# Altium schematic sheet LCCAtmegaXXM1.2.SchDoc
size A0
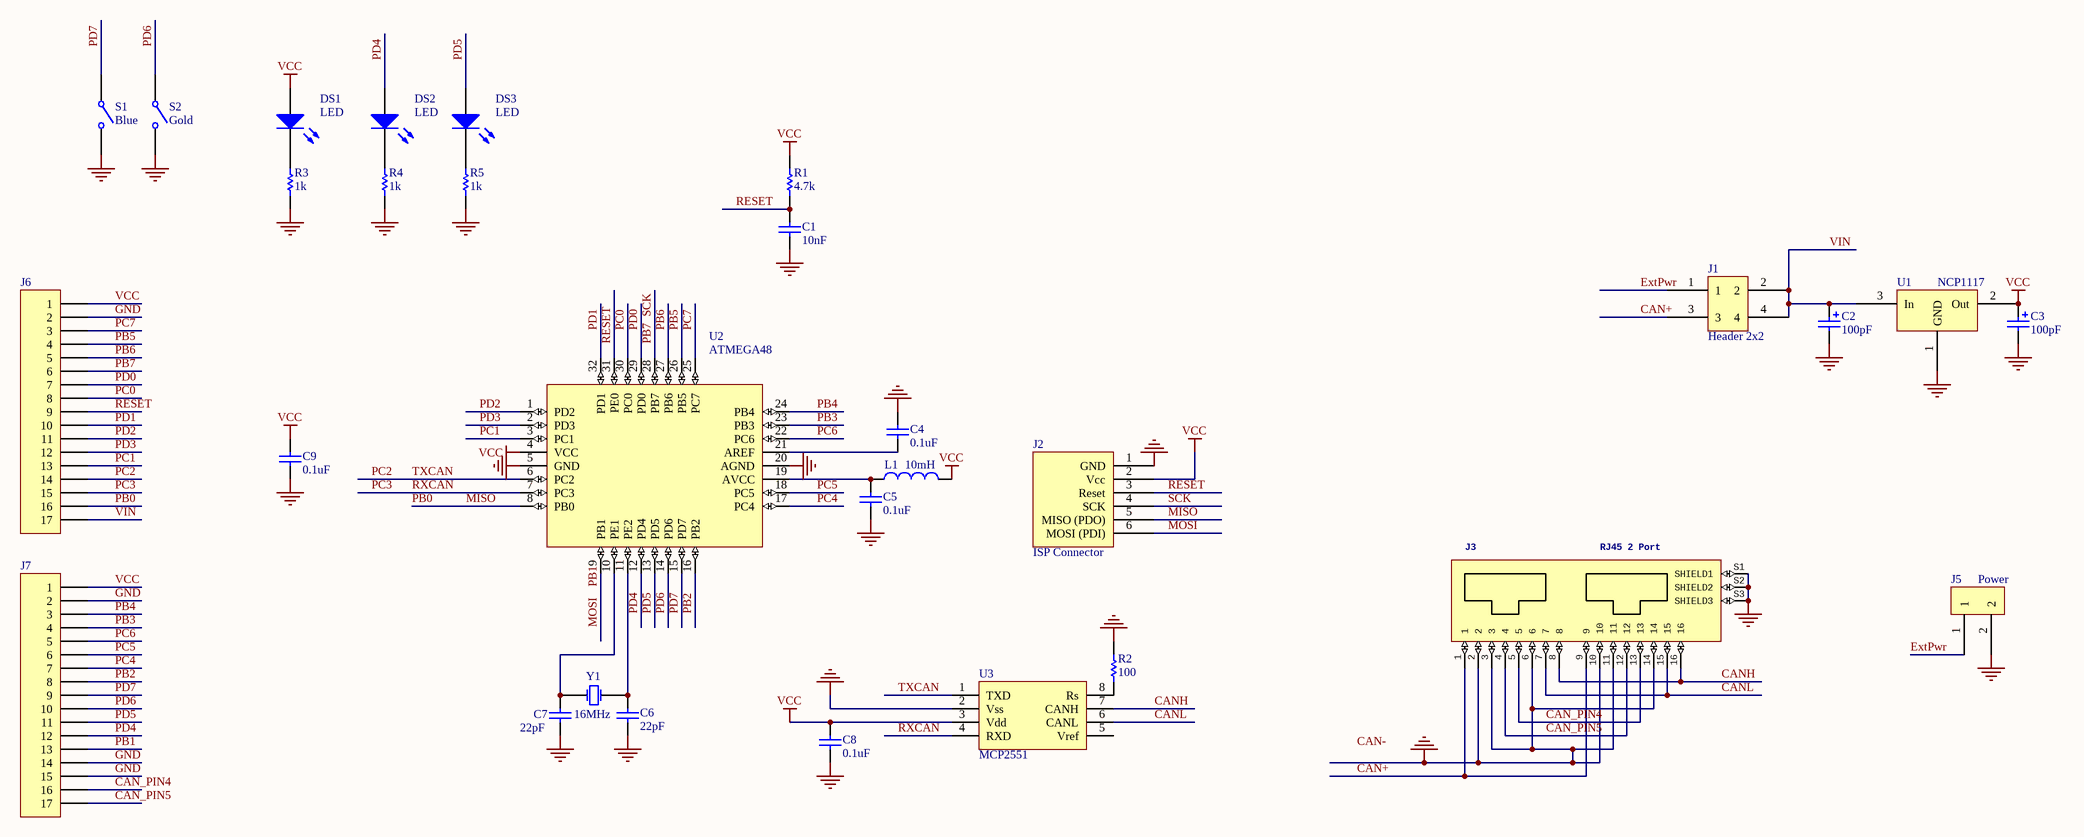
[diagram p0: LCCAtmegaXXM1.2.SchDoc]

## Parts
C1  value 10nF  [Cap SMD 0805A]  (hidden comment: Cap)
C2  value 100pF  [Cap SMD Elect 5x5.3]  (hidden comment: Cap Pol)
C3  value 100pF  [Cap SMD Elect 5x5.3]  (hidden comment: Cap Pol)
C4  value 0.1uF  [Cap SMD 0805A]  (hidden comment: Cap)
C5  value 0.1uF  [Cap SMD 0805A]  (hidden comment: Cap)
C6  value 22pF  [Cap SMD 0805A]  (hidden comment: Cap)
C7  value 22pF  [Cap SMD 0805A]  (hidden comment: Cap)
C8  value 0.1uF  [Cap SMD 0805A]  (hidden comment: Cap)
C9  value 0.1uF  [Cap SMD 0805A]  (hidden comment: Cap)
DS1  LED  [LED SMD 0805]
DS2  LED  [LED SMD 0805]
DS3  LED  [LED SMD 0805]
J1  Header 2x2  [HDR2x2]
J2  ISP Connector  [HDR2x3]
J3  RJ45 2 Port  [432238128]
J5  Power  [DC 2.5mm PCB Jack]
J6  Header 17  [HDR1X17]  (value not drawn)
J7  Header 17  [HDR1X17]  (value not drawn)
L1  value 10mH  [Cap SMD 0805A]  (hidden comment: Inductor)
R1  value 4.7k  [Res SMD 0805A]  (hidden comment: Res1)
R2  value 100  [Res SMD 0805A]  (hidden comment: Res1)
R3  value 1k  [Res SMD 0805A]  (hidden comment: Res1)
R4  value 1k  [Res SMD 0805A]  (hidden comment: Res1)
R5  value 1k  [Res SMD 0805A]  (hidden comment: Res1)
S1  Blue  [SPST Tactile 6x3.5]
S2  Gold  [SPST Tactile 6x3.5]
U1  NCP1117  [SOT-223]
U2  ATMEGA48  [TQFP32]
U3  MCP2551  [SOIC8]
Y1  16MHz  [Crystal TXC SMD]

## Nets
GND: C1.2 C2.2 C3.2 C4.2 C5.2 C6.1 C7.1 C8.2 C9.2 J2.1(GND) J3.2 J3.3 J3.6 J3.10 J3.11 J3.14 J3.S1(SHIELD1) J3.S2(SHIELD2) J3.S3(SHIELD3) J5.2 J6.2 J7.2 J7.14 J7.15 R2.1 R3.1 R4.1 R5.1 S1.2 S2.2 U1.1(GND) U2.5(GND) U2.20(AGND) U3.2(Vss)
VCC: C3.1 C8.1 C9.1 DS1.A J2.2(Vcc) J6.1 J7.1 L1.2 R1.2 U1.2(Out) U2.4(VCC) U3.3(Vdd)
CAN+: J1.3 J3.1 J3.9
CAN_PIN4: J3.5 J3.13 J7.16
CAN_PIN5: J3.4 J3.12 J7.17
CANH: J3.8 J3.16 U3.7(CANH)
CANL: J3.7 J3.15 U3.6(CANL)
ExtPwr: J1.1 J5.1
MISO: J2.5(MISO_(PDO)) J6.16 U2.8(PB0)  [also labelled PB0]
MOSI: J2.6(MOSI_(PDI)) J7.13 U2.9(PB1)  [also labelled PB1]
PB2: J7.8 U2.16(PB2)
PB3: J7.4 U2.23(PB3)
PB4: J7.3 U2.24(PB4)
PB5: J6.4 U2.26(PB5)
PB6: J6.5 U2.27(PB6)
PB7: J2.4(SCK) J6.6 U2.28(PB7)  [also labelled SCK]
PC0: J6.8 U2.30(PC0)
PC1: J6.13 U2.3(PC1)
PC2: J6.14 U2.6(PC2) U3.1(TXD)  [also labelled TXCAN]
PC3: J6.15 U2.7(PC3) U3.4(RXD)  [also labelled RXCAN]
PC4: J7.7 U2.17(PC4)
PC5: J7.6 U2.18(PC5)
PC6: J7.5 U2.22(PC6)
PC7: J6.3 U2.25(PC7)
PD0: J6.7 U2.29(PD0)
PD1: J6.10 U2.32(PD1)
PD2: J6.11 U2.1(PD2)
PD3: J6.12 U2.2(PD3)
PD4: DS2.A J7.12 U2.12(PD4)
PD5: DS3.A J7.11 U2.13(PD5)
PD6: J7.10 S2.1 U2.14(PD6)
PD7: J7.9 S1.1 U2.15(PD7)
RESET: C1.1 J2.3(Reset) J6.9 R1.1 U2.31(PE0)
VIN: C2.1 J1.2 J1.4 J6.17 U1.3(In)
NetC4_1: C4.1 U2.21(AREF)
NetC5_1: C5.1 L1.1 U2.19(AVCC)
NetC6_2: C6.2 U2.11(PE2) Y1.2(OSC2)
NetC7_2: C7.2 U2.10(PE1) Y1.1(OSC1)
NetDS1_K: DS1.K R3.2
NetDS2_K: DS2.K R4.2
NetDS3_K: DS3.K R5.2
NetR2_2: R2.2 U3.8(Rs)

Not connected (* = marked no-connect by the designer): U3 5(Vref)

## Notes on the sheet
- Labels drawn without touching a wire or pin: CAN-

## Library data of the parts
C1 C4-C9 = Cap: Capacitor; Published: 8-Jun-2000; LatestRevisionDate: 17-Jul-2002; LatestRevisionNote: Re-released for DXP Platform.; PackageReference: RAD-0.3; Publisher: Altium Limited; PackageDescription: Radial Cap, Thru-Hole; 2 Leads; 0.3 in Pin Spacing
C2 C3 = Cap Pol: Polarized Capacitor (Radial); Published: 8-Jun-2000; LatestRevisionDate: 17-Jul-2002; LatestRevisionNote: Re-released for DXP Platform.; PackageReference: RB7.6-15; Publisher: Altium Limited; PackageDescription: Polarized Capacitor (Radial); 2 Leads
DS1-DS3 = LED: RGB LED Common Anode; Published: 8-Jun-2000; Revision: July-2002: Re-released for DXP Platform.; Publisher: Altium Limited
J1 = HDR2x2
J2 = ISP Connector: pin to pad: 1>6 3>5 4>3 5>1 6>4
J3 = 43223-8128_1: Manufacturer_Name: Molex; GateName_1: G$1; SymbolName_1: 43223-8128; LibraryName: 43223-8128; DeviceSetName: 43223-8128; Mouser_Part_Number: 538-43223-8128; Mouser_Price-Stock: https://www.mouser.com/Search/Refine.aspx?Keyword=538-43223-8128; Manufacturer_Part_Number: 43223-8128; Height: 13.69mm
J5 = SIP2 CONNECTOR
J6 J7 = Header 17: Header, 17-Pin; LatestRevisionDate: 17-Jul-2002; LatestRevisionNote: Re-released for DXP Platform.; Publisher: Altium Limited
L1 = Inductor: Code_IEC: 1005; Published: 8-Jun-2000; LatestRevisionDate: 29-May-2009; LatestRevisionNote: IPC-7351 Footprint Added.; PackageReference: 0402-A; Publisher: Altium Limited; PackageDescription: Chip Inductor; Code_JEITA: 0402
R1-R5 = Resistor
S1 S2 = SW-PB-SPST: Push Button, Single-Pole, Single-Throw; Published: 24-Mar-1999; Revision: July-2002: Re-released for DXP Platform.; Publisher: Altium Limited
U1 = NCP1117: LDO Regulator
U2 = ATMEGA64M1: 8-Bit AVR Microcontroller; Package Information: Latest Revision: revB, Oct-2001; Code - JEDEC: MS-026-ABA; Published: 17-Sep-2003; Datasheet: Latest Revision: 1042G-AVR-09/02; Package Reference: 32A; Publisher: Altium Limited
U3 = MCP2551: MCP2551 High Speed CAN Transceiver
Y1 = XTAL: Crystal Oscillator; Published: 8-Jun-2000; LatestRevisionDate: 17-Jul-2002; LatestRevisionNote: Re-released for DXP Platform.; PackageReference: R38; Publisher: Altium Limited; PackageDescription: Crystal, Thru-Hole; 2 Leads; Body 3.1 x 8.2 mm (Dia.xH)